# Altium schematic sheet sdram.SchDoc: Copper Suicide - SDRAM
size Letter; CheckedBy: J. Brinton; CompanyName: Signal Laboratories, Inc.; DrawnBy: J. Brinton; Engineer: J. Brinton; Address1: 3479 Edison Way; Address2: Menlo Park CA 94025; Address3: +1 (877) 778-8435; Address4: siglabs.com; Revision: 3; SheetNumber: 20; SheetTotal: 47
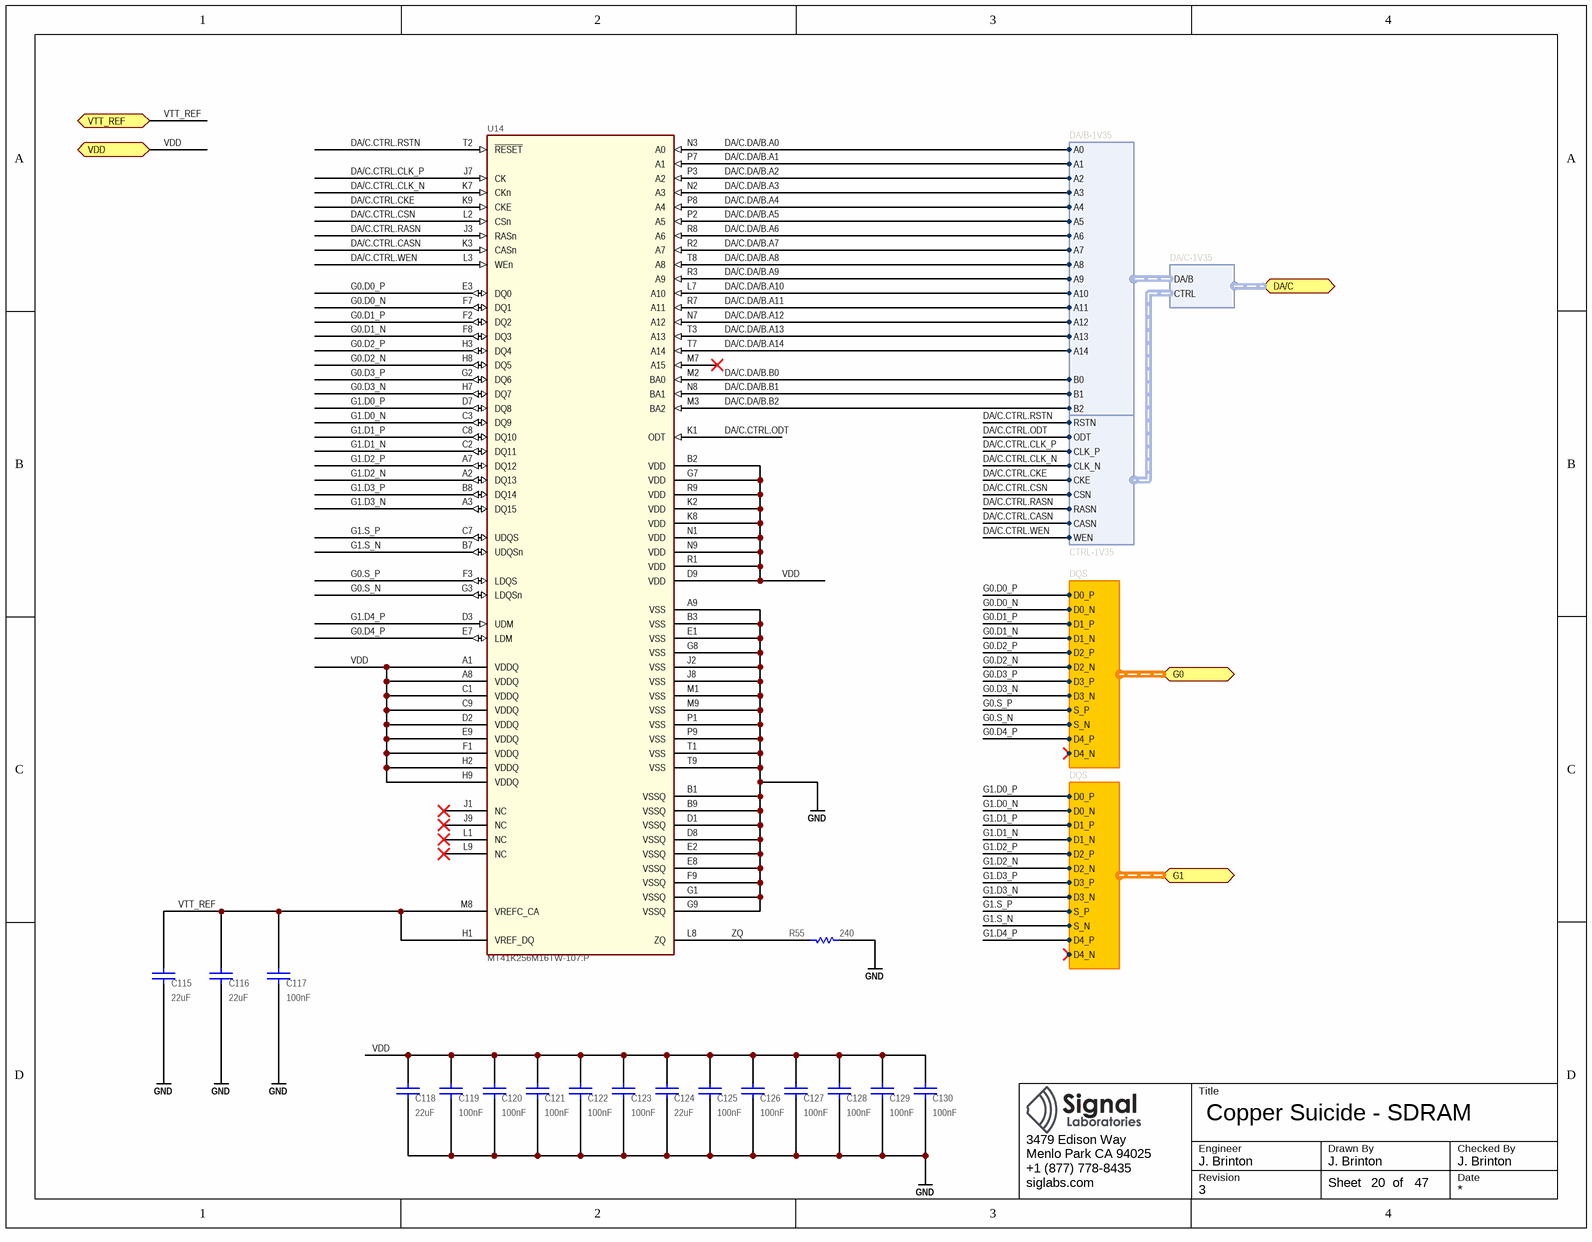
[diagram p0: sdram.SchDoc]

## Parts
C115  value 22uF  [CAPC200X125X145L45N]  (hidden comment: C2012X7S1A226M125)
C116  value 22uF  [CAPC200X125X145L45N]  (hidden comment: C2012X7S1A226M125)
C117  value 100nF  [CAPC100X50X55L25N]  (hidden comment: GCM155R71H104KE02)
C118  value 22uF  [CAPC200X125X145L45N]  (hidden comment: C2012X7S1A226M125)
C119  value 100nF  [CAPC100X50X55L25N]  (hidden comment: GCM155R71H104KE02)
C120  value 100nF  [CAPC100X50X55L25N]  (hidden comment: GCM155R71H104KE02)
C121  value 100nF  [CAPC100X50X55L25N]  (hidden comment: GCM155R71H104KE02)
C122  value 100nF  [CAPC100X50X55L25N]  (hidden comment: GCM155R71H104KE02)
C123  value 100nF  [CAPC100X50X55L25N]  (hidden comment: GCM155R71H104KE02)
C124  value 22uF  [CAPC200X125X145L45N]  (hidden comment: C2012X7S1A226M125)
C125  value 100nF  [CAPC100X50X55L25N]  (hidden comment: GCM155R71H104KE02)
C126  value 100nF  [CAPC100X50X55L25N]  (hidden comment: GCM155R71H104KE02)
C127  value 100nF  [CAPC100X50X55L25N]  (hidden comment: GCM155R71H104KE02)
C128  value 100nF  [CAPC100X50X55L25N]  (hidden comment: GCM155R71H104KE02)
C129  value 100nF  [CAPC100X50X55L25N]  (hidden comment: GCM155R71H104KE02)
C130  value 100nF  [CAPC100X50X55L25N]  (hidden comment: GCM155R71H104KE02)
R55  value 240  [RESC1005X40N]  (hidden comment: ERJ-2RKF2400X)
U14  MT41K256M16TW-107:P  [MT41K256M16TW-107:P]

## Ports
DA/C (harness DA/C-1V35), G0 (harness DQS), G1 (harness DQS), VDD, VTT_REF

## Harnesses
DA/B-1V35: A0, A1, A2, A3, A4, A5, A6, A7, A8, A9, A10, A11, A12, A13, A14, B0, B1, B2
CTRL-1V35: RSTN, CLK_P, CLK_N, CKE, CSN, RASN, CASN, WEN, ODT
DA/C-1V35: DA/B, CTRL
DQS: D0_P, D0_N, D1_P, D1_N, D2_P, D2_N, D3_P, D3_N, D4_P, D4_N, S_P, S_N

## Nets
GND: C115.2 C116.2 C117.1 C118.2 C119.1 C120.1 C121.1 C122.1 C123.1 C124.2 C125.1 C126.1 C127.1 C128.1 C129.1 C130.1 R55.1 U14.A9(VSS) U14.B1(VSSQ) U14.B3(VSS) U14.B9(VSSQ) U14.D1(VSSQ) U14.D8(VSSQ) U14.E1(VSS) U14.E2(VSSQ) U14.E8(VSSQ) U14.F9(VSSQ) U14.G1(VSSQ) U14.G8(VSS) U14.G9(VSSQ) U14.J2(VSS) U14.J8(VSS) U14.M1(VSS) U14.M9(VSS) U14.P1(VSS) U14.P9(VSS) U14.T1(VSS) U14.T9(VSS)
DA/C.CTRL.CASN: U14.K3(CASn) ; harness CTRL-1V35.CASN
DA/C.CTRL.CKE: U14.K9(CKE) ; harness CTRL-1V35.CKE
DA/C.CTRL.CLK_N: U14.K7(CKn) ; harness CTRL-1V35.CLK_N
DA/C.CTRL.CLK_P: U14.J7(CK) ; harness CTRL-1V35.CLK_P
DA/C.CTRL.CSN: U14.L2(CSn) ; harness CTRL-1V35.CSN
DA/C.CTRL.ODT: U14.K1(ODT) ; harness CTRL-1V35.ODT
DA/C.CTRL.RASN: U14.J3(RASn) ; harness CTRL-1V35.RASN
DA/C.CTRL.RSTN: U14.T2(~{RESET}) ; harness CTRL-1V35.RSTN
DA/C.CTRL.WEN: U14.L3(WEn) ; harness CTRL-1V35.WEN
DA/C.DA/B.A0: U14.N3(A0) ; harness DA/B-1V35.A0
DA/C.DA/B.A1: U14.P7(A1) ; harness DA/B-1V35.A1
DA/C.DA/B.A2: U14.P3(A2) ; harness DA/B-1V35.A2
DA/C.DA/B.A3: U14.N2(A3) ; harness DA/B-1V35.A3
DA/C.DA/B.A4: U14.P8(A4) ; harness DA/B-1V35.A4
DA/C.DA/B.A5: U14.P2(A5) ; harness DA/B-1V35.A5
DA/C.DA/B.A6: U14.R8(A6) ; harness DA/B-1V35.A6
DA/C.DA/B.A7: U14.R2(A7) ; harness DA/B-1V35.A7
DA/C.DA/B.A8: U14.T8(A8) ; harness DA/B-1V35.A8
DA/C.DA/B.A9: U14.R3(A9) ; harness DA/B-1V35.A9
DA/C.DA/B.A10: U14.L7(A10) ; harness DA/B-1V35.A10
DA/C.DA/B.A11: U14.R7(A11) ; harness DA/B-1V35.A11
DA/C.DA/B.A12: U14.N7(A12) ; harness DA/B-1V35.A12
DA/C.DA/B.A13: U14.T3(A13) ; harness DA/B-1V35.A13
DA/C.DA/B.A14: U14.T7(A14) ; harness DA/B-1V35.A14
DA/C.DA/B.B0: U14.M2(BA0) ; harness DA/B-1V35.B0
DA/C.DA/B.B1: U14.N8(BA1) ; harness DA/B-1V35.B1
DA/C.DA/B.B2: U14.M3(BA2) ; harness DA/B-1V35.B2
G0.D0_N: U14.F7(DQ1) ; port G0.D0_N
G0.D0_P: U14.E3(DQ0) ; port G0.D0_P
G0.D1_N: U14.F8(DQ3) ; port G0.D1_N
G0.D1_P: U14.F2(DQ2) ; port G0.D1_P
G0.D2_N: U14.H8(DQ5) ; port G0.D2_N
G0.D2_P: U14.H3(DQ4) ; port G0.D2_P
G0.D3_N: U14.H7(DQ7) ; port G0.D3_N
G0.D3_P: U14.G2(DQ6) ; port G0.D3_P
G0.D4_P: U14.E7(LDM) ; port G0.D4_P
G0.S_N: U14.G3(LDQSn) ; port G0.S_N
G0.S_P: U14.F3(LDQS) ; port G0.S_P
G1.D0_N: U14.C3(DQ9) ; port G1.D0_N
G1.D0_P: U14.D7(DQ8) ; port G1.D0_P
G1.D1_N: U14.C2(DQ11) ; port G1.D1_N
G1.D1_P: U14.C8(DQ10) ; port G1.D1_P
G1.D2_N: U14.A2(DQ13) ; port G1.D2_N
G1.D2_P: U14.A7(DQ12) ; port G1.D2_P
G1.D3_N: U14.A3(DQ15) ; port G1.D3_N
G1.D3_P: U14.B8(DQ14) ; port G1.D3_P
G1.D4_P: U14.D3(UDM) ; port G1.D4_P
G1.S_N: U14.B7(UDQSn) ; port G1.S_N
G1.S_P: U14.C7(UDQS) ; port G1.S_P
VDD: C118.1 C119.2 C120.2 C121.2 C122.2 C123.2 C124.1 C125.2 C126.2 C127.2 C128.2 C129.2 C130.2 U14.A1(VDDQ) U14.A8(VDDQ) U14.B2(VDD) U14.C1(VDDQ) U14.C9(VDDQ) U14.D2(VDDQ) U14.D9(VDD) U14.E9(VDDQ) U14.F1(VDDQ) U14.G7(VDD) U14.H2(VDDQ) U14.H9(VDDQ) U14.K2(VDD) U14.K8(VDD) U14.N1(VDD) U14.N9(VDD) U14.R1(VDD) U14.R9(VDD) ; port VDD
VTT_REF: C115.1 C116.1 C117.2 U14.H1(VREF_DQ) U14.M8(VREFC_CA) ; port VTT_REF
ZQ: R55.2 U14.L8(ZQ)

Not connected (* = marked no-connect by the designer): U14 J1(NC)* J9(NC)* L1(NC)* L9(NC)* M7(A15)*

## Notes on the sheet
- Title
- Engineer
- Revision
- Drawn By
- Checked By
- Date
- Sheet
- of

## Library data of the parts
C115 C116 C118 C124 = CAP: Ceramic Capacitor 22uF ±20% 10V X7S 0805; Manufacturer: TDK; Tr: -55:125; Tolerance: ±20%; Manufacturer P/N: C2012X7S1A226M125; Voltage: 10V; Footprint: *; Package: 0805
C117 C119-C123 C125-C130 = CAP: Ceramic Capacitor 100nF ±10% 50V X7R 0402; Manufacturer: Murata; Tr: -55:125; Tolerance: ±10%; Manufacturer P/N: GCM155R71H104KE02; Voltage: 50V; Footprint: *; Package: 0402
R55 = RES: Thick Film Resistor 240 ±1% 0.1W 75V 0402; Manufacturer: Panasonic; Tcr: ±100; Tr: -55:155; Voltage: 75; Power: 0.1; Tolerance: ±1%; Manufacturer P/N: ERJ-2RKF2400X; Alternatives: *; Footprint: *; Package: 0402
U14 = MT41K256M16HA: DDR3L SDRAM 4Gb (32Megx16bitx8banks); Manufacturer: Micron Technology; Manufacturer P/N: MT41K256M16TW-107:P